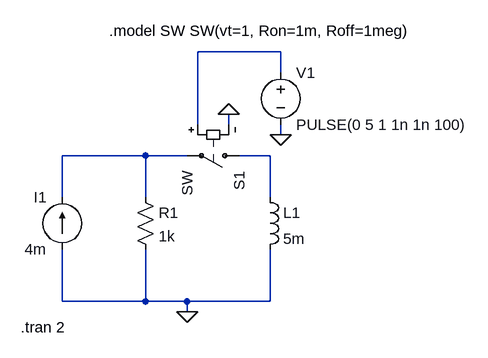
[diagram p0: schematic SwitchCircuit.asc]
SwitchCircuit.asc, the LTspice schematic file:
Version 4
SHEET 1 880 680
WIRE 400 -112 272 -112
WIRE 400 -80 400 -112
WIRE 272 0 272 -112
WIRE 320 0 320 -16
WIRE 400 16 400 0
WIRE 192 48 64 48
WIRE 256 48 192 48
WIRE 384 48 336 48
WIRE 64 112 64 48
WIRE 192 112 192 48
WIRE 384 112 384 48
WIRE 64 272 64 192
WIRE 192 272 192 192
WIRE 192 272 64 272
WIRE 256 272 192 272
WIRE 384 272 384 192
WIRE 384 272 256 272
WIRE 256 288 256 272
FLAG 320 -16 0
FLAG 400 16 0
FLAG 256 288 0
SYMBOL current 64 192 R180
WINDOW 0 24 80 Left 2
WINDOW 3 24 0 Left 2
WINDOW 123 0 0 Left 0
WINDOW 39 0 0 Left 0
SYMATTR InstName I1
SYMATTR Value 4m
SYMBOL res 176 96 R0
SYMATTR InstName R1
SYMATTR Value 1k
SYMBOL ind 368 96 R0
SYMATTR InstName L1
SYMATTR Value 5m
SYMBOL sw 352 48 R90
SYMATTR InstName S1
SYMBOL voltage 400 -96 R0
WINDOW 123 0 0 Left 0
WINDOW 39 0 0 Left 0
SYMATTR InstName V1
SYMATTR Value PULSE(0 5 1 1n 1n 100)
TEXT 136 -144 Left 2 !.model SW SW(vt=1, Ron=1m, Roff=1meg)
TEXT 0 312 Left 2 !.tran 2

The netlist it stands for:
* SwitchCircuit.asc
I1 0 N002 4m
R1 N002 0 1k
L1 N003 0 5m
S1 N003 N002 N001 0 SW
V1 N001 0 PULSE(0 5 1 1n 1n 100)
.model SW SW(vt=1, Ron=1m, Roff=1meg)
.tran 2
.backanno
.end